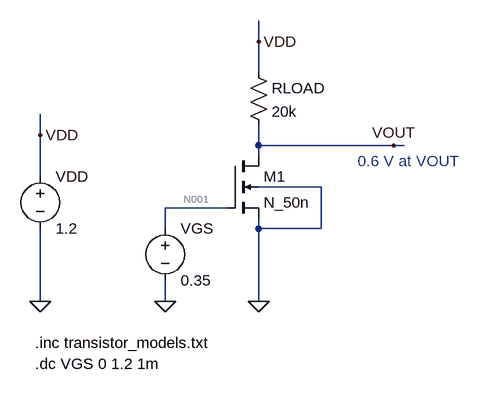
[diagram p0: schematic lab06_cs_amp.asc]
lab06_cs_amp.asc, the LTspice schematic file:
Version 4
SHEET 1 880 680
WIRE 160 -128 160 -160
WIRE 160 -80 160 -128
WIRE -176 16 -176 -16
WIRE 160 32 160 0
WIRE 368 32 160 32
WIRE 384 32 368 32
WIRE 160 48 160 32
WIRE -176 80 -176 16
WIRE 256 96 160 96
WIRE 112 128 16 128
WIRE 16 160 16 128
WIRE 160 160 160 144
WIRE 256 160 256 96
WIRE 256 160 160 160
WIRE -176 272 -176 160
WIRE 16 272 16 240
WIRE 160 272 160 160
FLAG 160 272 0
FLAG 16 272 0
FLAG -176 272 0
FLAG -176 16 VDD
FLAG 160 -128 VDD
FLAG 368 32 VOUT
SYMBOL nmos4 112 48 R0
SYMATTR InstName M1
SYMATTR Value N_50n
SYMATTR Value2 l=1u w=10u
SYMBOL voltage 16 144 R0
WINDOW 123 0 0 Left 0
WINDOW 39 0 0 Left 0
SYMATTR InstName VGS
SYMATTR Value 0.35
SYMBOL voltage -176 64 R0
WINDOW 123 0 0 Left 0
WINDOW 39 0 0 Left 0
SYMATTR InstName VDD
SYMATTR Value 1.2
SYMBOL res 144 -96 R0
SYMATTR InstName RLOAD
SYMATTR Value 20k
TEXT -184 336 Left 2 !.inc transistor_models.txt
TEXT -184 368 Left 2 !.dc VGS 0 1.2 1m
TEXT 312 56 Left 2 ;0.6 V at VOUT

The netlist it stands for:
* lab06_cs_amp.asc
M1 VOUT N001 0 0 N_50n l=1u w=10u
VGS N001 0 0.35
VDD VDD 0 1.2
RLOAD VDD VOUT 20k
.model NMOS NMOS
.model PMOS PMOS
.lib standard.mos
.inc transistor_models.txt
.dc VGS 0 1.2 1m
* 0.6 V at VOUT
.backanno
.end

* Results of the author's LTspice run, read from the files saved beside the schematic
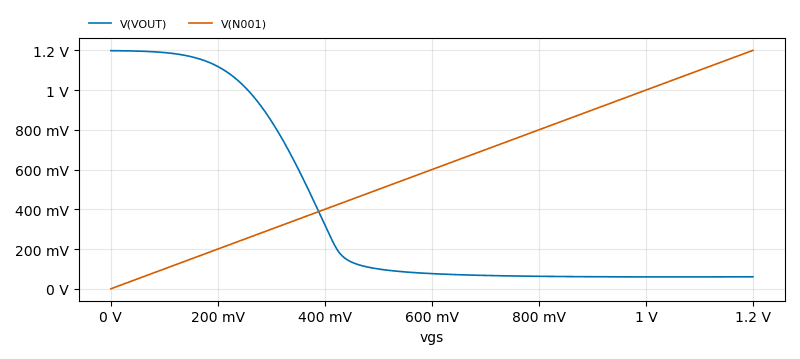
[diagram p1: DC transfer characteristic of lab06_cs_amp.asc, plotted from the saved traces]
* DC transfer characteristic, 1 run:
*   V(VOUT): 1.199 V at vgs=0 V, 60.48 mV at vgs=1.2 V, min 59.77 mV, max 1.199 V
*   V(N001): 0 V at vgs=0 V, 1.2 V at vgs=1.2 V, min 0 V, max 1.2 V